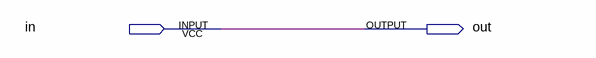
[diagram p0: schematic sheet]
// Quartus schematic Test.bdf as structural Verilog: 0 symbols, 2 pins
module Test (
  input  in,
  output out
);


  assign out = in;
endmodule
